# EAGLE schematic VCADual_Test (EAGLE 7.6.0)
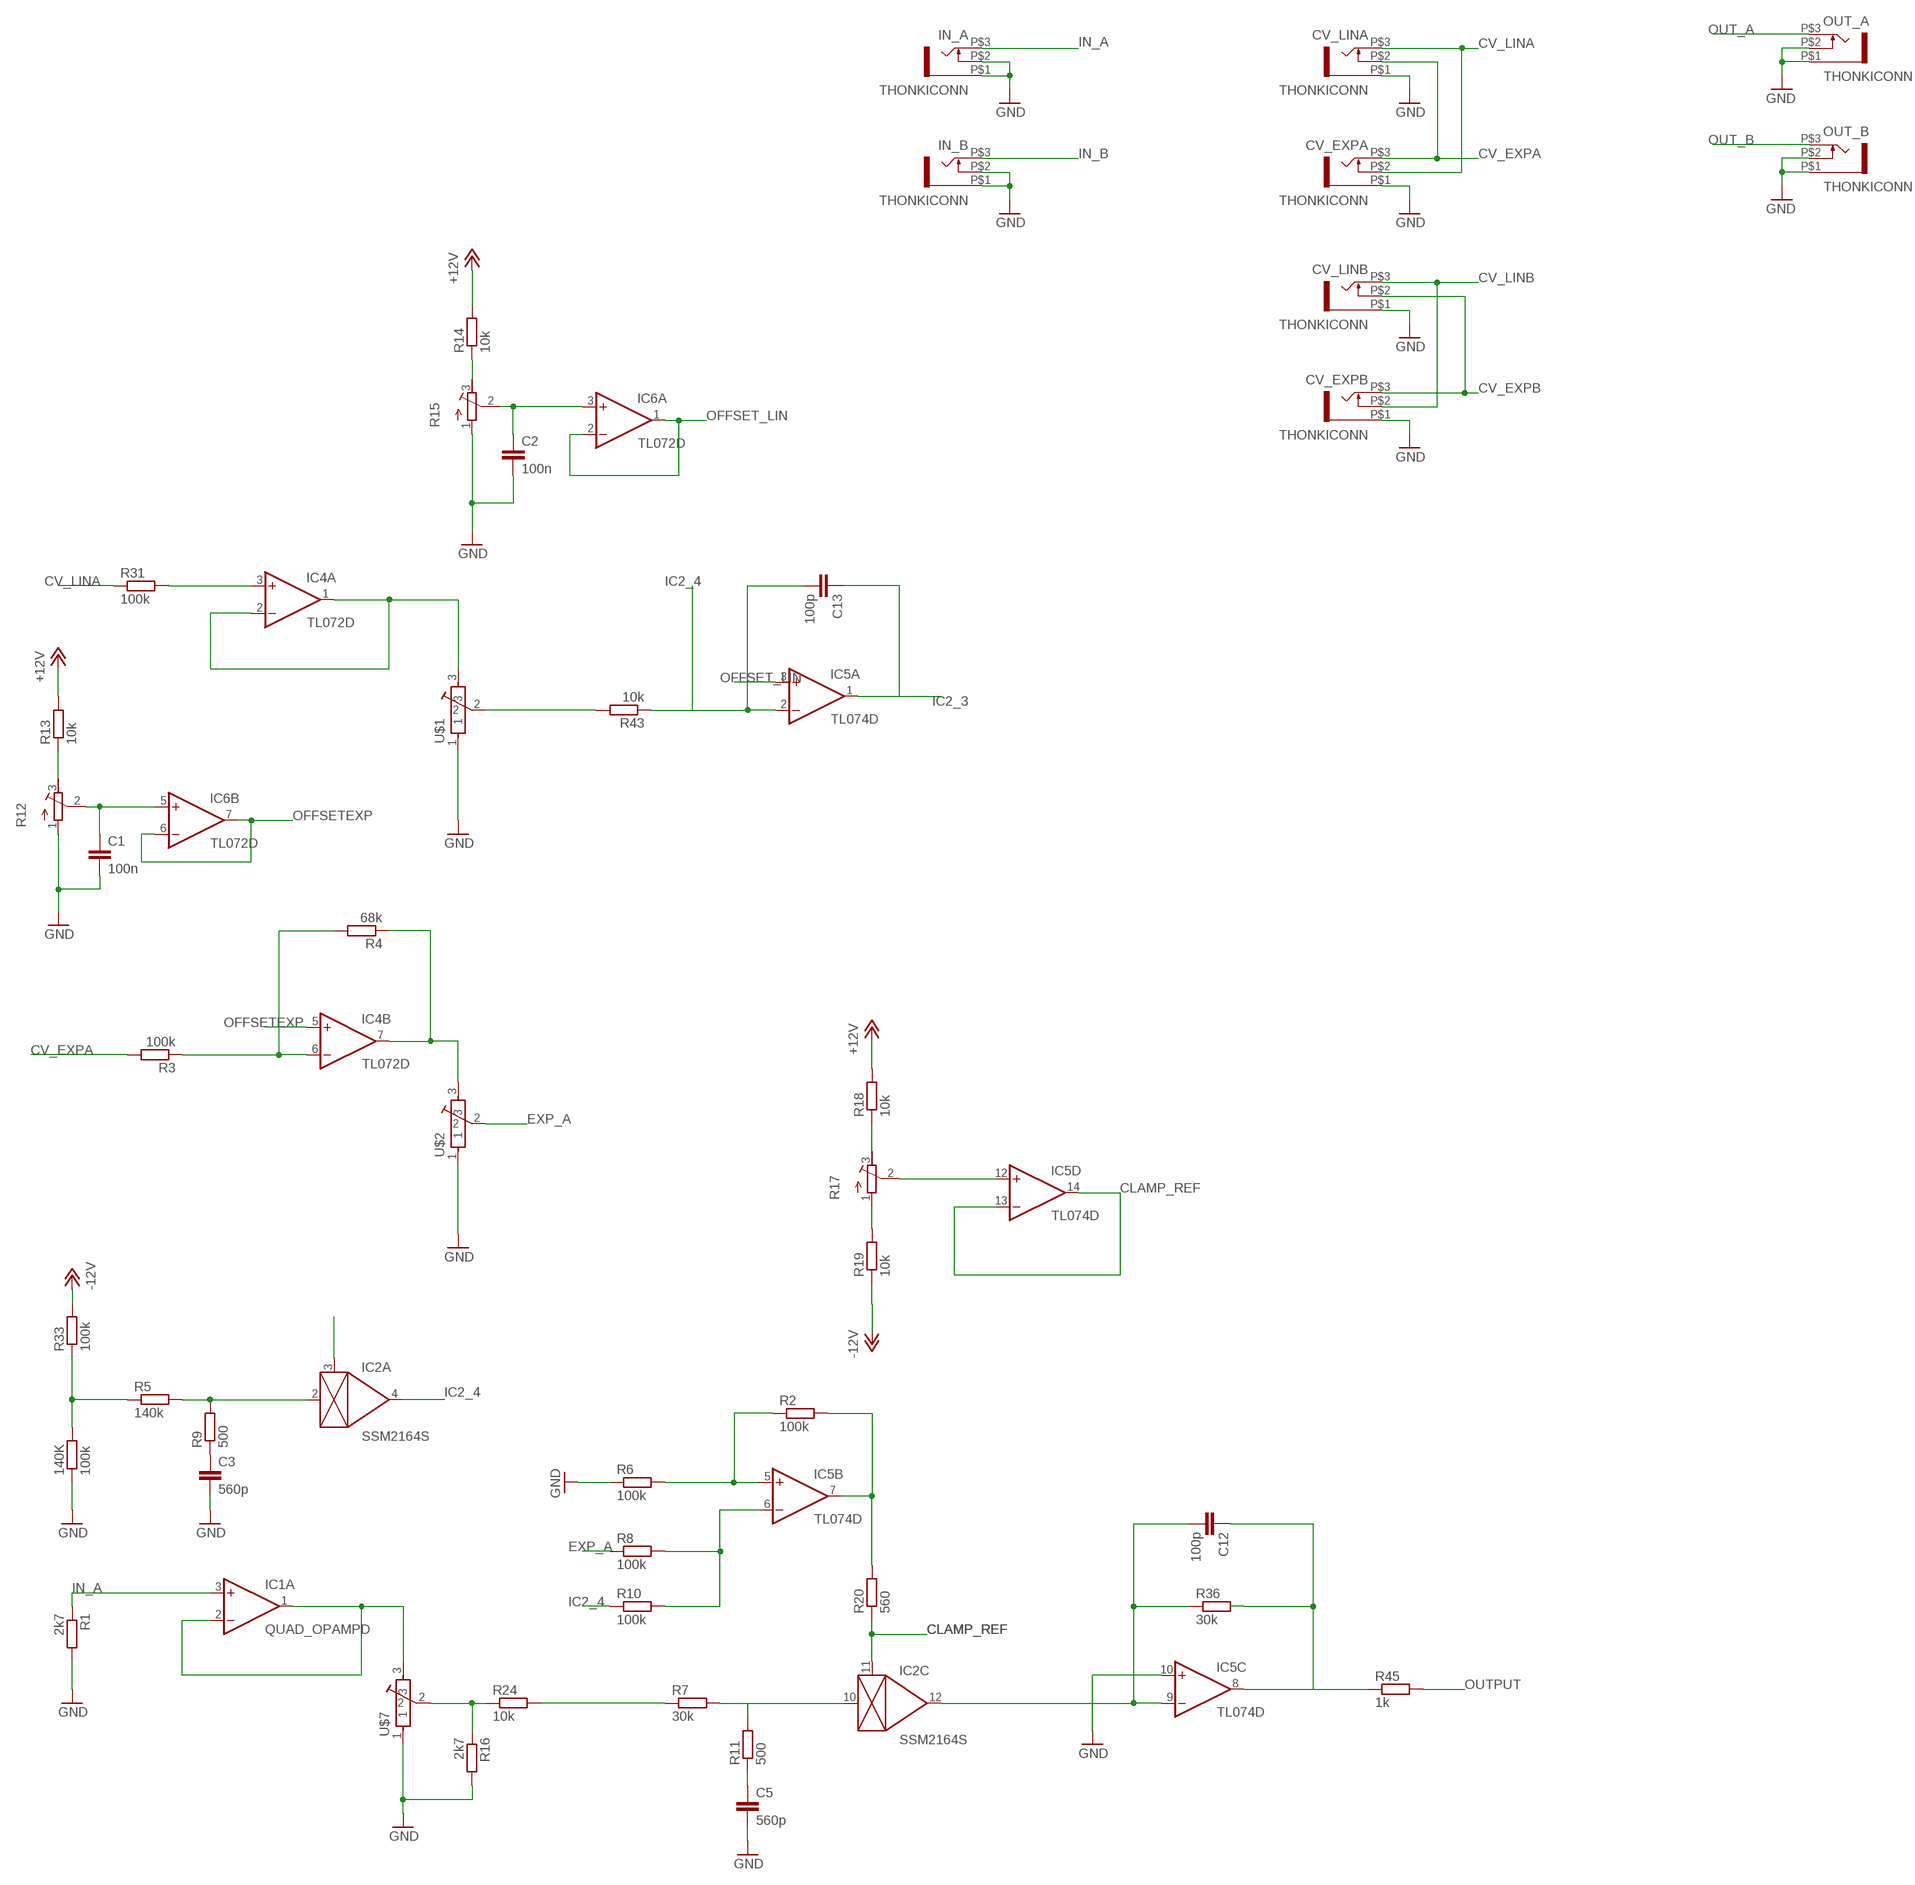
[diagram p0: schematic, sheet 1]

## Parts
140K  100k  R-EU_0603  [0603]
C1  100n  C-EUC0603K  [C0603K]
C2  100n  C-EUC0603K  [C0603K]
C3  560p  C-EUC0603K  [C0603K]
C5  560p  C-EUC0603K  [C0603K]
C12  100p  C-EUC0603K  [C0603K]
C13  100p  C-EUC0603K  [C0603K]
CV_EXPA  THONKICONN  [THONKICONN]
CV_EXPB  THONKICONN  [THONKICONN]
CV_LINA  THONKICONN  [THONKICONN]
CV_LINB  THONKICONN  [THONKICONN]
IC1  QUAD_OPAMPD  [SO14]
IC2  SSM2164S  [SOIC16N]
IC4  TL072D  [SO08]
IC5  TL074D  [SO14]
IC6  TL072D  [SO08]
IN_A  THONKICONN  [THONKICONN]
IN_B  THONKICONN  [THONKICONN]
OUT_A  THONKICONN  [THONKICONN]
OUT_B  THONKICONN  [THONKICONN]
R1  2k7  R-EU_0603  [0603]
R2  100k  R-EU_0603  [0603]
R3  100k  R-EU_0603  [0603]
R4  68k  R-EU_0603  [0603]
R5  140k  R-EU_0603  [0603]
R6  100k  R-EU_0603  [0603]
R7  30k  R-EU_0603  [0603]
R8  100k  R-EU_0603  [0603]
R9  500  R-EU_0603  [0603]
R10  100k  R-EU_0603  [0603]
R11  500  R-EU_0603  [0603]
R12  R-TRIMM64X  [RTRIM64X]
R13  10k  R-EU_0603  [0603]
R14  10k  R-EU_0603  [0603]
R15  R-TRIMM64X  [RTRIM64X]
R16  2k7  R-EU_0603  [0603]
R17  R-TRIMM64X  [RTRIM64X]
R18  10k  R-EU_0603  [0603]
R19  10k  R-EU_0603  [0603]
R20  560  R-EU_0603  [0603]
R24  10k  R-EU_0603  [0603]
R31  100k  R-EU_0603  [0603]
R33  100k  R-EU_0603  [0603]
R36  30k  R-EU_0603  [0603]
R43  10k  R-EU_0603  [0603]
R45  1k  R-EU_0603  [0603]
U$1  POT-ALPS-RK09L1140  [POT-ALPS-RK09L1140]
U$2  POT-ALPS-RK09L1140  [POT-ALPS-RK09L1140]
U$7  POT-ALPS-RK09L1140  [POT-ALPS-RK09L1140]

## Nets
+12V: R13.2 R14.2 R18.2
-10V: 140K.2 R5.1 R33.1
-12V: R19.1 R33.2
CLAMP_REF: IC2.11(C:CTRL) IC5.13(D:-IN) IC5.14(D:OUT) R20.1
CV_EXPA: CV_EXPA.P$3 CV_LINA.P$2 R3.2
CV_EXPB: CV_EXPB.P$3 CV_LINB.P$2
CV_LINA: CV_EXPA.P$2 CV_LINA.P$3 R31.1
CV_LINB: CV_EXPB.P$2 CV_LINB.P$3
EXP_A: R8.1 U$2.2
GND: 140K.1 C1.2 C2.2 C3.2 C5.2 CV_EXPA.P$1 CV_EXPB.P$1 CV_LINA.P$1 CV_LINB.P$1 IC5.10(C:+IN) IN_A.P$1 IN_A.P$2 IN_B.P$1 IN_B.P$2 OUT_A.P$1 OUT_A.P$2 OUT_B.P$1 OUT_B.P$2 R1.2 R6.1 R12.1(A) R15.1(A) R16.2 U$1.1 U$2.1 U$7.1
IC2_1: IC4.6(B:-IN) R3.1 R4.2
IC2_3: C13.1 IC2.3(A:CTRL) IC5.1(A:OUT)
IC2_4: C13.2 IC2.4(A:OUT) IC5.2(A:-IN) R10.1 R43.1
IC2_11: IC5.7(B:OUT) R2.2 R20.2
IN_A: IC1.3(A:+IN) IN_A.P$3 R1.1
IN_B: IN_B.P$3
N$1: IC1.1(A:OUT) IC1.2(A:-IN) U$7.3
N$2: C1.1 IC6.5(B:+IN) R12.2(S)
N$3: R12.3(E) R13.1
N$4: IC4.7(B:OUT) R4.1 U$2.3
N$5: IC5.5(B:+IN) R2.1 R6.2
N$6: R8.2 R10.2
N$7: R14.1 R15.3(E)
N$8: C2.1 IC6.3(A:+IN) R15.2(S)
N$9: R17.1(A) R19.2
N$10: R17.3(E) R18.1
N$11: IC5.12(D:+IN) R17.2(S)
N$18: IC2.2(A:IN) R5.2 R9.2
N$19: C5.1 R11.1
N$20: C3.1 R9.1
N$23: IC2.10(C:IN) R7.2 R11.2
N$26: R7.1 R24.2
N$34: R16.1 R24.1 U$7.2
N$39: IC4.3(A:+IN) R31.2
N$42: IC4.1(A:OUT) IC4.2(A:-IN) U$1.3
N$49: C12.2 IC2.12(C:OUT) IC5.9(C:-IN) R36.1
N$50: R43.2 U$1.2
N$51: C12.1 IC5.8(C:OUT) R36.2 R45.1
OFFSET_LIN: IC5.3(A:+IN) IC6.1(A:OUT) IC6.2(A:-IN)
OFFSETEXP: IC4.5(B:+IN) IC6.6(B:-IN) IC6.7(B:OUT)
OUT_A: OUT_A.P$3
OUT_B: OUT_B.P$3
OUTPUT: R45.2
Unconnected: IC1.5(B:+IN) IC1.6(B:-IN) IC1.7(B:OUT) IC1.8(C:OUT) IC1.9(C:-IN) IC1.10(C:+IN) IC1.12(D:+IN) IC1.13(D:-IN) IC1.14(D:OUT) IC2.1(E:MODE) IC2.5(B:OUT) IC2.6(B:CTRL) IC2.7(B:IN) IC2.13(D:OUT) IC2.14(D:CTRL) IC2.15(D:IN) IC5.6(B:-IN) U$1.P$5 U$1.P$6 U$2.P$5 U$2.P$6 U$7.P$5 U$7.P$6

## Power pins joined to a net without a drawn wire
GND: IC2.8(E:GND)
V+: IC1.4(P:V+) IC2.16(E:V+) IC4.8(P:V+) IC5.4(P:V+) IC6.8(P:V+)
V-: IC1.11(P:V-) IC2.9(E:V-) IC4.4(P:V-) IC5.11(P:V-) IC6.4(P:V-)

## Library data of the parts
140K R1-R11 R13 R14 R16 R18-R20 R24 R31 R33 R36 R43 R45 = Rebel:R-EU_: RESISTOR, European symbol
C1-C3 C5 C12 C13 = resistor:C-EU: CAPACITOR, European symbol
CV_EXPA CV_EXPB CV_LINA CV_LINB IN_A IN_B OUT_A OUT_B = Rebel:THONKICONN
IC1 = adafruit:QUAD_OPAMP: OP AMP Standard quad package
IC2 = ssm2164:SSM2164
IC4 IC6 = linear:TL072: OP AMP
IC5 = linear:TL074: OP AMP
R12 R15 R17 = resistor:R-TRIMM: Trimm resistor
U$1 U$2 U$7 = Rebel:POT-ALPS-RK09L